# Altium schematic sheet MCU.SchDoc
size A
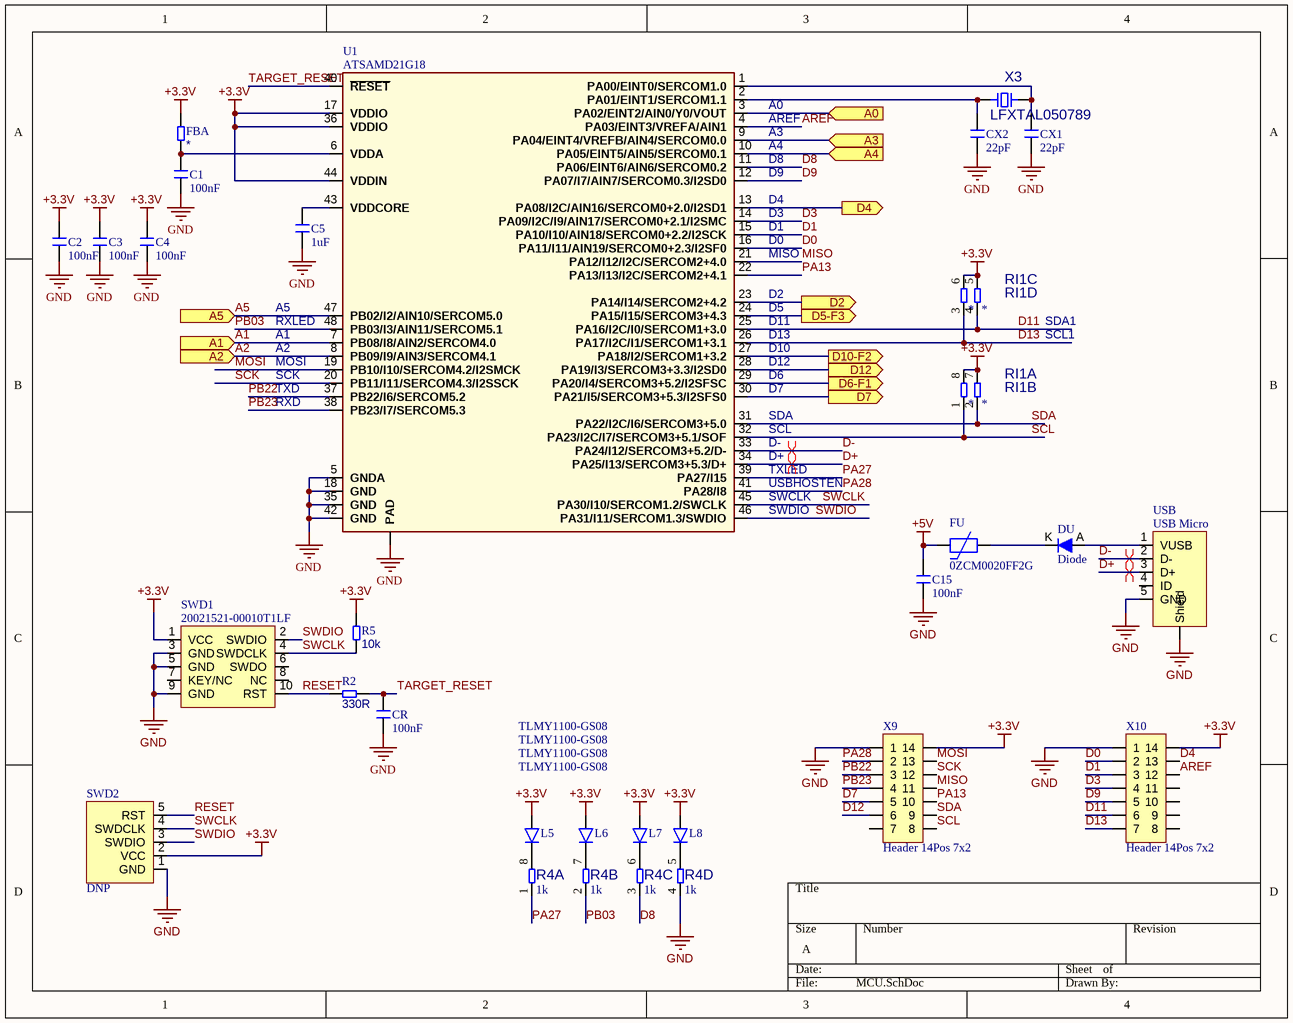
[diagram p0: MCU.SchDoc]

## Parts
C1  100nF  [C0603_N]
C2  100nF  [C0603_N]
C3  100nF  [C0603_N]
C4  100nF  [C0603_N]
C5  1uF  [C0603_N]
C15  100nF  [C0603_N]
CR  100nF  [C0603_N]
CX1  22pF  [C0603_N]
CX2  22pF  [C0603_N]
DU  Diode  [SOD323F]
FBA  Ferrite  [R0603]  (value not drawn)
FU  0ZCM0020FF2G  [PTC0603]
L5  TLMY1100-GS08  [LED 0603 Reverse]
L6  TLMY1100-GS08  [LED 0603 Reverse]
L7  TLMY1100-GS08  [LED 0603 Reverse]
L8  TLMY1100-GS08  [LED 0603 Reverse]
R2  330R  [R0603]
R4  1k  [YC164]  (parts A,B,C,D of 4)
R5  10k  [R0603]
RI1  4k7  [YC164]  (value not drawn)  (parts A,B,C,D of 4)
SWD1  20021521-00010T1LF  [Header 10P 50mil]
SWD2  DNP  [SWD 5Pin SMD]
U1  ATSAMD21G18  [QFN48_M]
USB  USB Micro  [USB Micro]
X3  LFXTAL050789  [Crystal 0805]
X9  Header 14Pos 7x2  [Header 7x2 SMD 2.54mm]
X10  Header 14Pos 7x2  [Header 7x2 SMD 2.54mm]

## Ports
A0 (in), A1 (in), A2 (in), A3 (in), A4 (in), A5 (in), D2 (out), D4 (out), D5-F3 (out), D6-F1 (out), D7 (out), D10-F2 (out), D12 (out)

## Nets
+3.3V: C2.1 C3.1 C4.1 FBA.2 L5.2(A) L6.2(A) L7.2(A) L8.2(A) R5.2 RI1.5 RI1.6 RI1.7 RI1.8 SWD1.1(VCC) SWD2.2(VCC) U1.17(VDDIO) U1.36(VDDIO) U1.44(VDDIN) X9.14 X10.14
+5V: C15.1 FU.1
GND: C1.2 C2.2 C3.2 C4.2 C5.2 C15.2 CR.2 CX1.2 CX2.2 R4.4 SWD1.3(GND) SWD1.5(GND) SWD1.9(GND) SWD2.1(GND) U1.5(GNDA) U1.18(GND) U1.35(GND) U1.42(GND) U1.49(PAD) USB.5(GND) USB.Shield X9.1 X10.1
A0: U1.3(PA02/EINT2/AIN0/Y0/VOUT) ; port A0
A1: U1.7(PB08/I8/AIN2/SERCOM4.0) ; port A1
A2: U1.8(PB09/I9/AIN3/SERCOM4.1) ; port A2
A3: U1.9(PA04/EINT4/VREFB/AIN4/SERCOM0.0) ; port A3
A4: U1.10(PA05/EINT5/AIN5/SERCOM0.1) ; port A4
A5: U1.47(PB02/I2/AIN10/SERCOM5.0) ; port A5
AREF: U1.4(PA03/EINT3/VREFA/AIN1) X10.12
D0: U1.16(PA11/I11/AIN19/SERCOM0+2.3/I2SF0) X10.2
D1: U1.15(PA10/I10/AIN18/SERCOM0+2.2/I2SCK) X10.3
D2: U1.23(PA14/I14/SERCOM2+4.2) ; port D2
D3: U1.14(PA09/I2C/I9/AIN17/SERCOM0+2.1/I2SMC) X10.4
D4: U1.13(PA08/I2C/AIN16/SERCOM0+2.0/I2SD1) ; port D4
D4: X10.13  [a separate net that carries the same name]
D5-F3: U1.24(PA15/I15/SERCOM3+4.3) ; port D5-F3
D6-F1: U1.29(PA20/I4/SERCOM3+5.2/I2SFSC) ; port D6-F1
D7: U1.30(PA21/I5/SERCOM3+5.3/I2SFS0) ; port D7
D7: X9.5  [a separate net that carries the same name]
D8: R4.3 U1.11(PA06/EINT6/AIN6/SERCOM0.2)
D9: U1.12(PA07/I7/AIN7/SERCOM0.3/I2SD0) X10.5
D10-F2: U1.27(PA18/I2/SERCOM1+3.2) ; port D10-F2
D11: RI1.4 U1.25(PA16/I2C/I0/SERCOM1+3.0) X10.6
D12: U1.28(PA19/I3/SERCOM3+3.3/I2SD0) ; port D12
D12: X9.6  [a separate net that carries the same name]
D13: RI1.3 U1.26(PA17/I2C/I1/SERCOM1+3.1) X10.7
D+: U1.34(PA25/I13/SERCOM3+5.3/D+) USB.3(D+)
D-: U1.33(PA24/I12/SERCOM3+5.2/D-) USB.2(D-)
MISO: U1.21(PA12/I12/I2C/SERCOM2+4.0) X9.11
MOSI: U1.19(PB10/I10/SERCOM4.2/I2SMCK) X9.13
PA13: U1.22(PA13/I13/I2C/SERCOM2+4.1) X9.10
PA27: R4.1 U1.39(PA27/I15)
PA28: U1.41(PA28/I8) X9.2
PB03: R4.2 U1.48(PB03/I3/AIN11/SERCOM5.1)
PB22: U1.37(PB22/I6/SERCOM5.2) X9.3
PB23: U1.38(PB23/I7/SERCOM5.3) X9.4
RESET: R2.1 SWD1.10(RST) SWD2.5(RST)
SCK: U1.20(PB11/I11/SERCOM4.3/I2SSCK) X9.12
SCL: RI1.1 U1.32(PA23/I2C/I7/SERCOM3+5.1/SOF) X9.8
SDA: RI1.2 U1.31(PA22/I2C/I6/SERCOM3+5.0) X9.9
SWCLK: R5.1 SWD1.4(SWDCLK) SWD2.4(SWDCLK) U1.45(PA30/I10/SERCOM1.2/SWCLK)
SWDIO: SWD1.2(SWDIO) SWD2.3(SWDIO) U1.46(PA31/I11/SERCOM1.3/SWDIO)
TARGET_RESET: CR.1 R2.2 U1.40(~{RESET})
NetC1_1: C1.1 FBA.1 U1.6(VDDA)
NetC5_1: C5.1 U1.43(VDDCORE)
NetCX1_1: CX1.1 U1.1(PA00/EINT0/SERCOM1.0) X3.2
NetCX2_1: CX2.1 U1.2(PA01/EINT1/SERCOM1.1) X3.1
NetDU_A: DU.A USB.1(VUSB)
NetDU_K: DU.K FU.2
NetL5_1: L5.1(K) R4.8
NetL6_1: L6.1(K) R4.7
NetL7_1: L7.1(K) R4.6
NetL8_1: L8.1(K) R4.5

Not connected (* = marked no-connect by the designer): SWD1 6(SWDO) 7(KEY/NC) 8(NC); USB 4(ID); X9 7; X10 8 9 10 11

## Layout directives
differential pair: D+, D-

## Notes on the sheet
- SDA1
- SCL1
- (in symbol ATSAMD21G18) A0; AREF; A3; A4; D8; D9; D4; D3; D1; D0; MISO; D2; A5; D5; RXLED; D11; A1; D13; A2; D10; MOSI; D12; SCK; D6; TXD; D7; RXD; SDA; SCL; D-; D+; TXLED; USBHOSTEN; SWCLK; SWDIO

## Library data of the parts
C1-C5 C15 CR CX1 CX2 = Capacitor: Capacitor MLCC; Manufacturer: Yageo; Manufacturer Part Number: CC0603KRX7R9BB104; Tolerance (%): 10; Category: Capacitor; Package: 0603; Supplier Part Number 1: 1362556; Supplier 1: Farnell; ComponentLink1URL: http://www.yageo.com; ComponentLink1Description: Manufacturer Website; Voltage Rating (Volts): *; Supplier 2: Digi-Key; Supplier Part Number 2: 311-1344-1-ND
  C1-C4 C15 CR: Value: 100nF
  C5: Value: 1uF
  CX1 CX2: Value: 22pF
FBA R2 R5 = Resistor: Published: 17-Dec-2003; LatestRevisionDate: 19-Mar-2004; LatestRevisionNote: Silkscreen size reduced.; PackageDocument: Mar-2003; PackageReference: 3-0603; Publisher: Altium Limited; Code_IPC: 1608 [0603]; ComponentLink1Description: Manufacturer Link; ComponentLink1URL: http://www.panasonic.com/industrial/components/resistive_products.htm; ComponentLink2Description: Datasheet; ComponentLink2URL: http://www.panasonic.com/industrial/components/pdf/AOA0000CE2.pdf
  FBA: Value: *
  R2: Value: 330R
  R5: Value: 10k
FU = PTC: PTC, Resettable Fuse
L5-L8 = LED
R4 RI1 = Resistor Array - 4P
  R4: Value: 1k
  RI1: Value: *
SWD1 = SWD
SWD2 = SWD 5 Pin
X3 = Crystal: Value: LFXTAL050789